# EAGLE design gameboy-link (EAGLE 7.7.0)
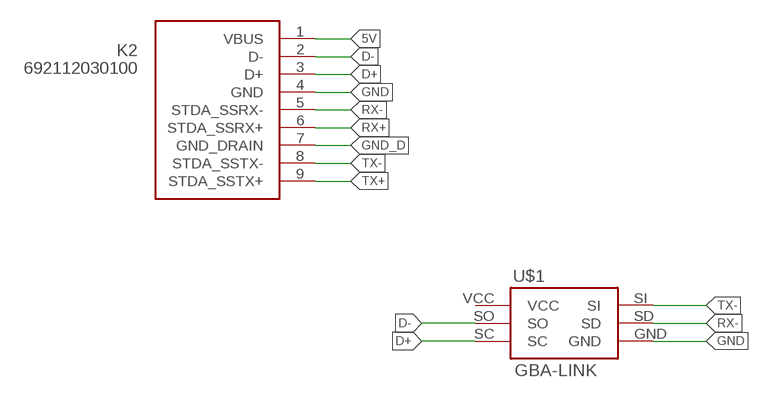
[diagram p0: schematic, sheet 1]

## Parts
K2  692112030100  [692112030100]
U$1  GBA-LINK  [GBA-LINK]

## Nets
5V: K2.1(VBUS)
D+: K2.3(D+) U$1.SC
D-: K2.2(D-) U$1.SO
GND: K2.4(GND) U$1.GND
GND_D: K2.7(GND_DRAIN)
RX+: K2.6(STDA_SSRX+)
RX-: K2.5(STDA_SSRX-) U$1.SD
TX+: K2.9(STDA_SSTX+)
TX-: K2.8(STDA_SSTX-) U$1.SI
Unconnected: U$1.S$1 U$1.S$2(S$1) U$1.VCC

## Library data of the parts
K2 = Wuerth_Elektronik_eiCan_Communication_Connectors_STENCIL:692112030100: WR-COM USB 3.0 SMT PLUG WITH CLIPTYPE A
U$1 = link_port:GBA-LINK

## Board
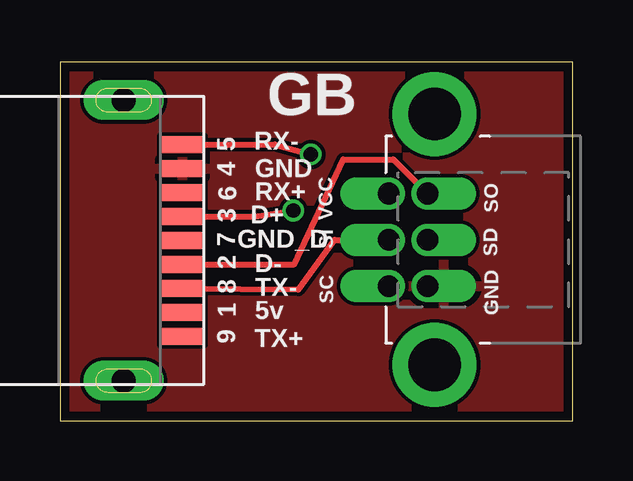
[diagram p1: board, top side]
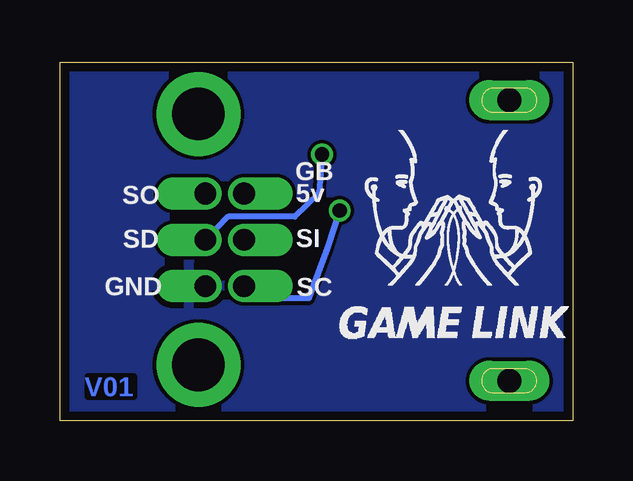
[diagram p2: board, bottom side, seen from below]

Size 21.39 x 14.96 mm. Coordinates in mm from the lower left corner, seen from the top.
Outline: 0,0 21.39,0 21.39,14.96 0,14.96 0,0
Copper layers (1*16): Top 0.035559375mm / dielectric 1.6mm / Bottom 0.035559375mm
Design rules "oshpark-2layer": minimum track width 6mil, minimum drill 10mil, track to track 6mil, track to pad 6mil, pad to pad 6mil, via to via 6mil, smd to smd 6mil, copper to edge 15mil, drill to drill 6mil, minimum pad ring 5mil, minimum via ring 5mil, stop-mask expansion 2.5mil, vias tented up to drill 0mil, thermal gap 10mil

### Footprints (pad centres in the part's own frame; a part is rotated, then mirrored left to right if it is on the bottom)
692112030100 = smd 0.7 x 1.8: 1 -3,0; 2 -1,0; 3 1,0; 4 3,0; 5 4,0; 6 2,0; 7 0,0; 8 -2,0; 9 -4,0 | drill 1 pad 1.676 long: Z1 5.85,2.45; Z2 -5.85,2.45
GBA-LINK = drill 0.9 pad 1.27 offset: GND -1.93,-1.61; SC -1.93,0; SD 0,-1.61; SI 0,0; SO 1.93,-1.61; VCC 1.93,0 | drill 2.2 pad 3.5: S$1 -5.22,-1.905; S$2 5.25,-1.905

### Placement (x,y rotation side)
K2  5.11,7.52 90 top
U$1  13.72,7.54 90 top

### Tracks (layer width: path | path; a pad name or v marks a point on that pad's centre or on a via)
D+  (via drill 0.6)
  Top 0.254: K2.3 8.14,8.52 v9.73,8.76
  Bottom 0.254: v9.73,8.76 10.24,7.21 11.02,5.11 13.21,5.11 U$1.SC
D-
  Top 0.254: K2.2 9.77,6.52 11.81,10.9 13.9,10.9 U$1.SO
GND
  pour Bottom: 0.23,14.73 21.01,14.83 21.16,0.25 0.23,0.28
  pour Top: 0.23,14.73 21.11,14.78 21.11,0.28 0.23,0.23
RX-  (via drill 0.6)
  Top 0.254: K2.5 8.95,11.52 v10.47,11.1
  Bottom 0.254: v10.47,11.1 10.59,9.5 11.61,8.51 14.39,8.51 U$1.SD
TX-
  Top 0.254: K2.8 9.94,5.47 11.46,7.54 U$1.SI

### Text on the board
Bottom: V01
tPlace: GB | 5 | RX- | 4 | GND | 6 | RX+ | 3 | D+ | 7 | GND_D | 2 | D- | 8 | TX- | 1 | 5v | 9 | TX+
bPlace: GB | 5v | SO | SI | SD | SC | GND